# EAGLE design Statemachine_ST7735 (EAGLE 6.4)
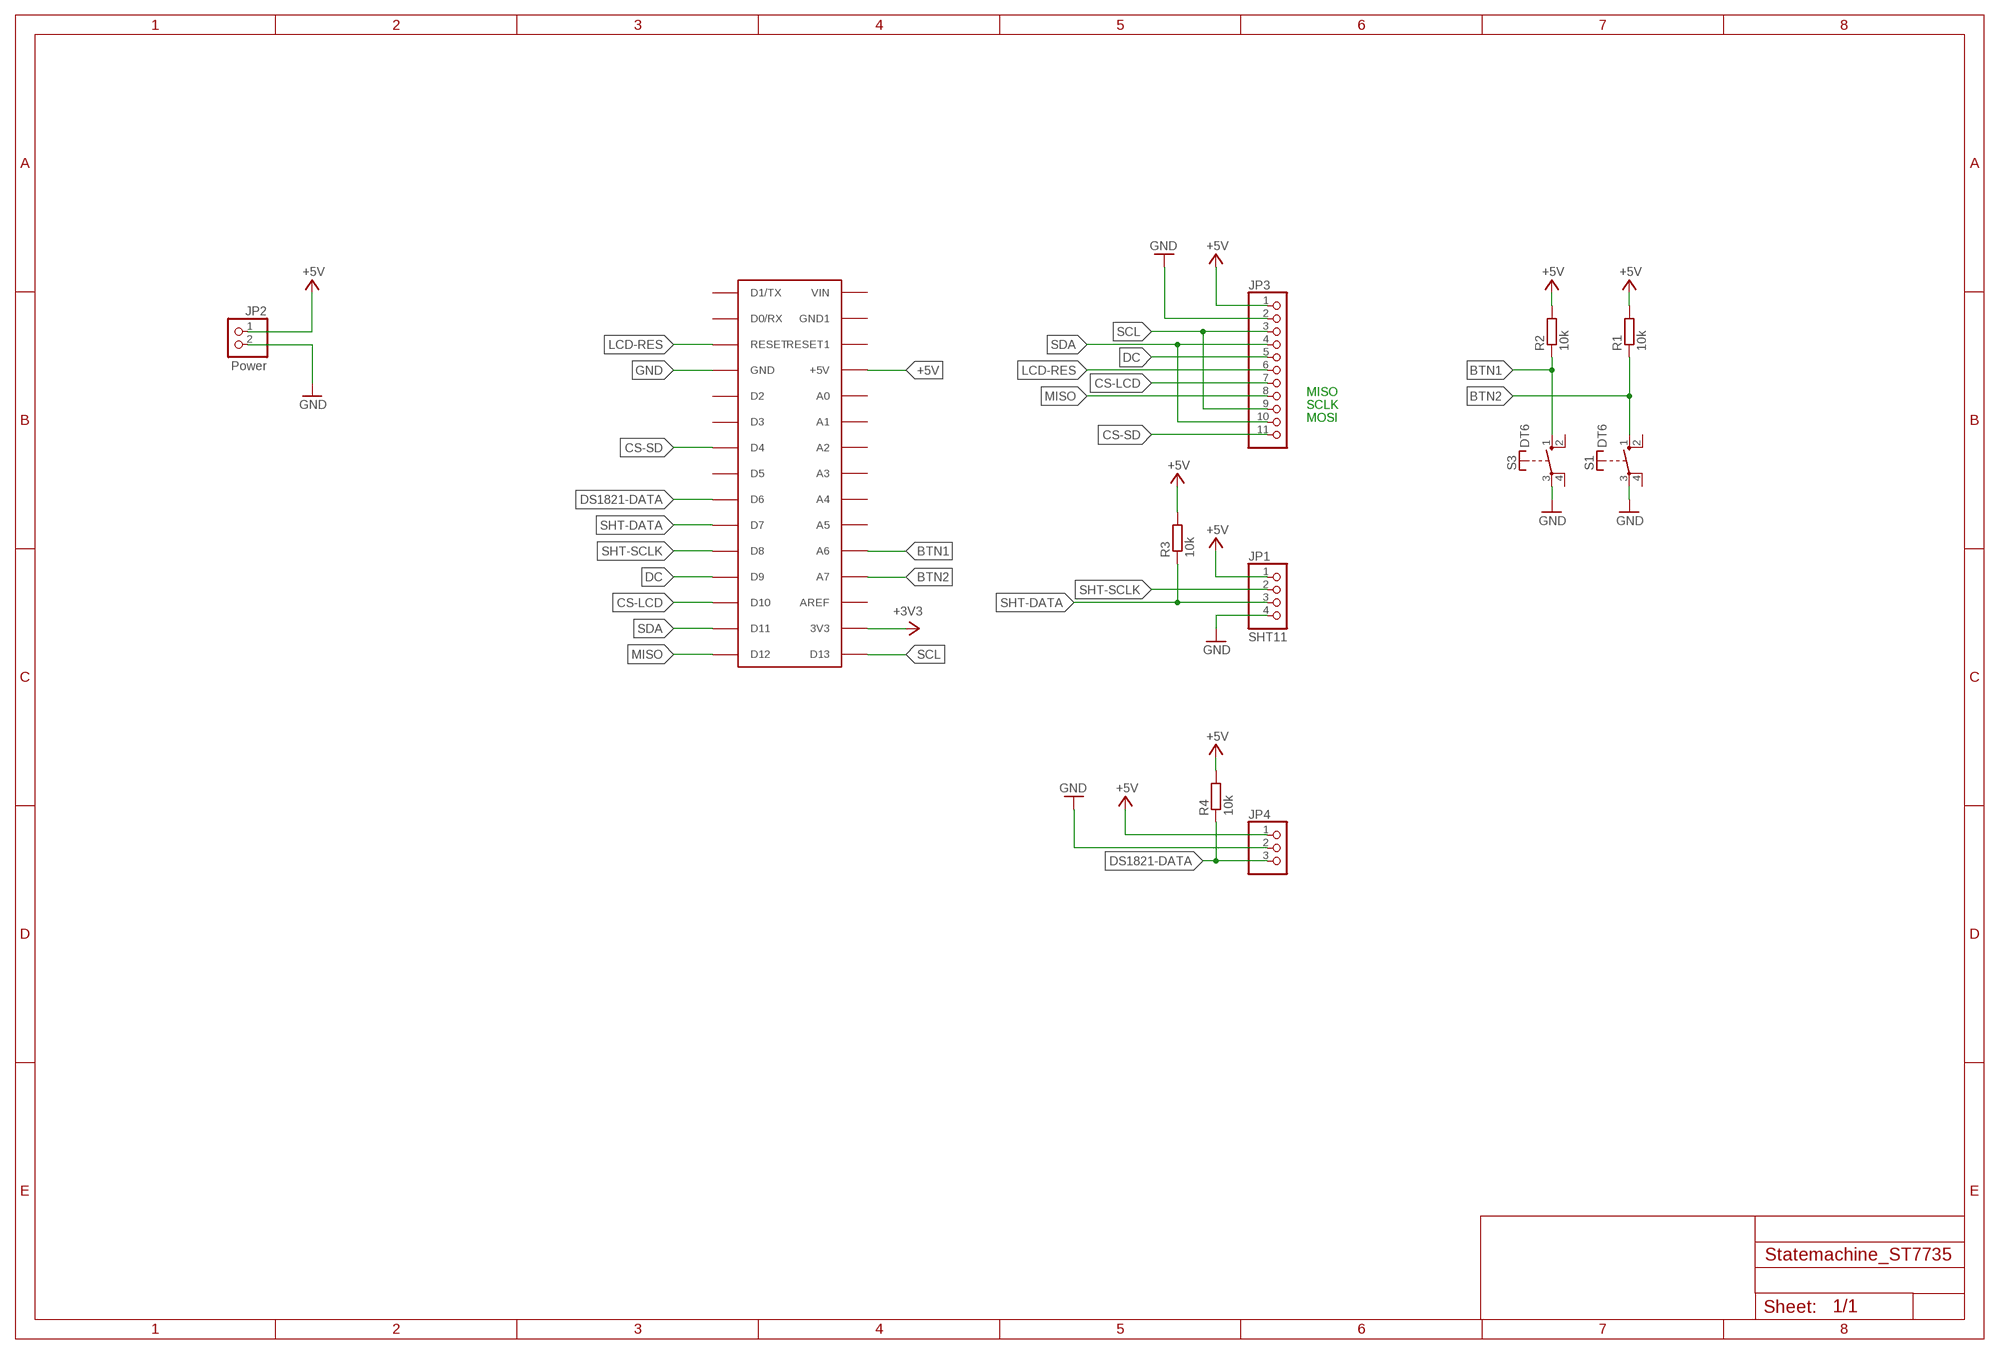
[diagram p0: schematic, sheet 1]

## Parts
JP1  SHT11  PINHD-1X4  [1X04]
JP2  Power  PINHD-1X2  [1X02]
JP3  PINHD-1X11  [1X11]
JP4  PINHD-1X3  [1X03]
R1  10k  R-EU_0207/10  [0207/10]
R2  10k  R-EU_0204/7  [0204/7]
R3  10k  R-EU_0204/7  [0204/7]
R4  10k  R-EU_0207/10  [0207/10]
S1  DT6  [DT6]
S3  DT6  [DT6]
U$1  ARDUINONANO  [PDIP-32]

## Nets
+3V3: U$1.3V3
+5V: JP1.1 JP2.1 JP3.1 JP4.1 R1.2 R2.2 R3.2 R4.2 U$1.+5V
BTN1: R2.1 S3.1(S) U$1.A6
BTN2: R1.1 S1.1(S) U$1.A7
CS-LCD: JP3.7 U$1.D10
CS-SD: JP3.11 U$1.D4
DC: JP3.5 U$1.D9
DS1821-DATA: JP4.3 R4.1 U$1.D6
GND: JP1.4 JP2.2 JP3.2 JP4.2 S1.3(P) S3.3(P) U$1.GND
LCD-RES: JP3.6 U$1.RESET
MISO: JP3.8 U$1.D12
SCL: JP3.3 JP3.9 U$1.D13
SDA: JP3.4 JP3.10 U$1.D11
SHT-DATA: JP1.3 R3.1 U$1.D7
SHT-SCLK: JP1.2 U$1.D8
Unconnected: S1.2(S) S1.4(P) S3.2(S) S3.4(P) U$1.A0 U$1.A1 U$1.A2 U$1.A3 U$1.A4 U$1.A5 U$1.AREF U$1.D0/RX U$1.D1/TX U$1.D2 U$1.D3 U$1.D5 U$1.GND1 U$1.RESET1 U$1.VIN

## Notes on the sheet
- MISO
- SCLK
- MOSI

## Library data of the parts
JP1 = pinhead:PINHD-1X4: PIN HEADER
JP2 = pinhead:PINHD-1X2: PIN HEADER
JP3 = pinhead:PINHD-1X11: PIN HEADER
JP4 = pinhead:PINHD-1X3: PIN HEADER
R1-R4 = resistor:R-EU_: RESISTOR, European symbol
S1 S3 = switch-misc:DT: ITT SWITCH
U$1 = arduino:ARDUINONANO

## Board
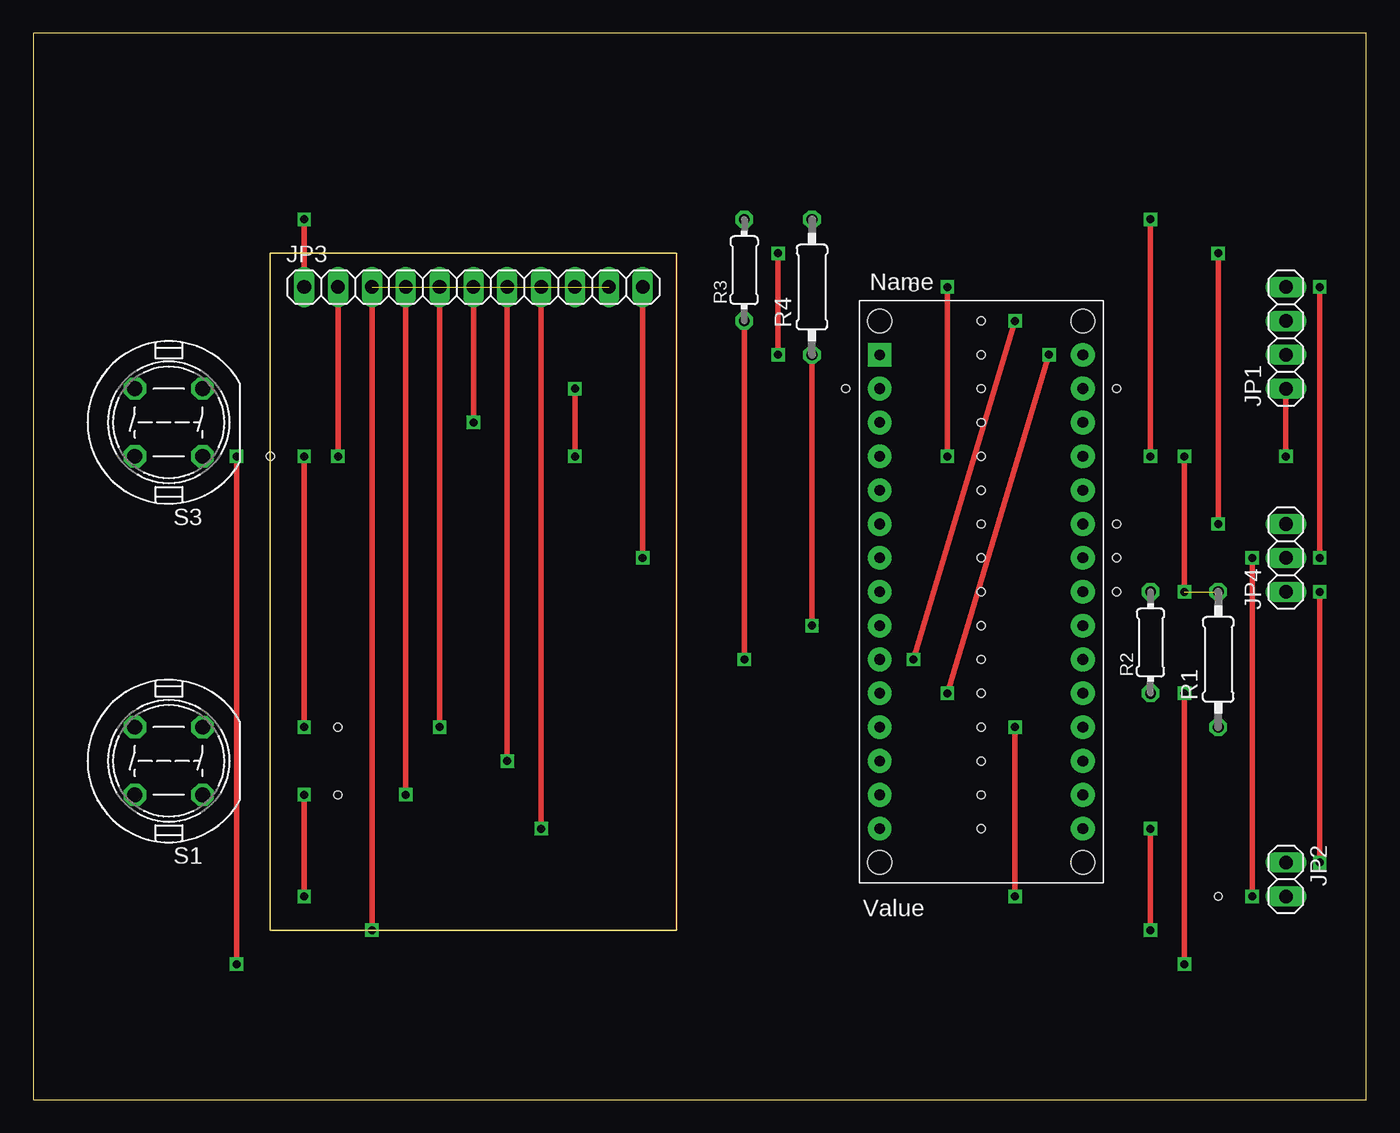
[diagram p1: board, top side]
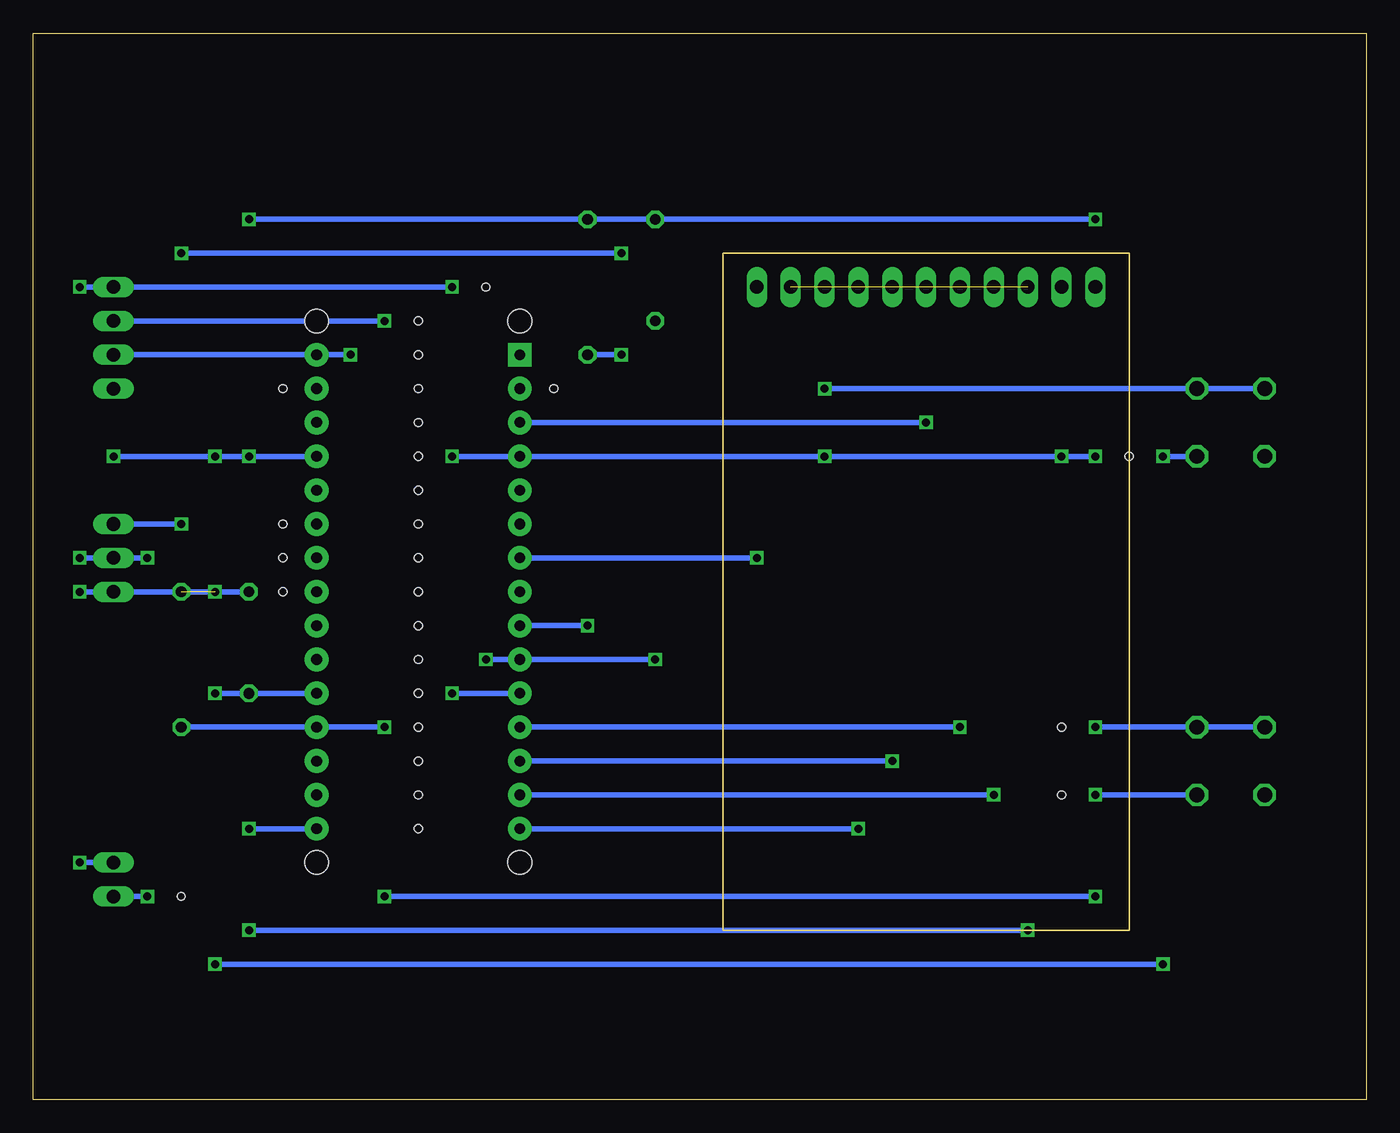
[diagram p2: board, bottom side, seen from below]

Size 100 x 80 mm. Coordinates in mm from the lower left corner, seen from the top.
Outline: 0,0 100,0 100,80 0,80 0,0
Copper layers (1*16): Top 0.035mm / dielectric 1.5mm / Bottom 0.035mm
Design rules "default": minimum track width 10mil, minimum drill 24mil, track to track 8mil, track to pad 8mil, pad to pad 8mil, via to via 8mil, smd to smd 8mil, copper to edge 40mil, drill to drill 8mil, minimum pad ring 10mil, minimum via ring 8mil, stop-mask expansion 4mil, vias tented up to drill 0mil, thermal gap 10mil
Holes 0.6 mm at 81.28,38.1 81.28,40.64 81.28,43.18 81.28,53.34 71.12,55.88 71.12,53.34 71.12,50.8 71.12,48.26 71.12,45.72 71.12,43.18 71.12,40.64 71.12,38.1 71.12,35.56 71.12,33.02 71.12,30.48 71.12,27.94 71.12,25.4 71.12,22.86 71.12,20.32 88.9,15.24 22.86,22.86 22.86,27.94 60.96,53.34 17.78,48.26 71.12,58.42 66.04,60.96

### Footprints (pad centres in the part's own frame; a part is rotated, then mirrored left to right if it is on the bottom)
1X04 = drill 1.016 long: 1 -3.81,0; 2 -1.27,0; 3 1.27,0; 4 3.81,0
1X02 = drill 1.016 long: 1 -1.27,0; 2 1.27,0
1X11 = drill 1.016 long: 1 -12.7,0; 2 -10.16,0; 3 -7.62,0; 4 -5.08,0; 5 -2.54,0; 6 0,0; 7 2.54,0; 8 5.08,0; 9 7.62,0; 10 10.16,0; 11 12.7,0
1X03 = drill 1.016 long: 1 -2.54,0; 2 0,0; 3 2.54,0
0207/10 = drill 0.813 octagon: 1 -5.08,0; 2 5.08,0
0204/7 = drill 0.813 octagon: 1 -3.81,0; 2 3.81,0
DT6 = drill 1.118 octagon: 1 -2.54,2.54; 2 2.54,2.54; 3 2.54,-2.54; 4 -2.54,-2.54
PDIP-32 = drill 0.8 pad 1.778: 3V3 15.24,-35.56; +5V 15.24,-10.16; A0 15.24,-12.7; A1 15.24,-15.24; A2 15.24,-17.78; A3 15.24,-20.32; A4 15.24,-22.86; A5 15.24,-25.4; A6 15.24,-27.94; A7 15.24,-30.48; AREF 15.24,-33.02; D0/RX 0,-5.08; D2 0,-12.7; D3 0,-15.24; D4 0,-17.78; D5 0,-20.32; D6 0,-22.86; D7 0,-25.4; D8 0,-27.94; D9 0,-30.48; D10 0,-33.02; D11 0,-35.56; D12 0,-38.1; D13 15.24,-38.1; GND 0,-10.16; GND1 15.24,-5.08; RESET 0,-7.62; RESET1 15.24,-7.62; VIN 15.24,-2.54 | drill 0.8 pad 1.778 square: D1/TX 0,-2.54 | hole 1.778: 0,0; 0,-40.64; 15.24,-40.64; 15.24,0

### Placement (x,y rotation side)
JP1  93.98,57.15 90 top
JP2  93.98,16.51 270 top
JP3  33.02,60.96 0 top
JP4  93.98,40.64 90 top
R1  88.9,33.02 90 top
R2  83.82,34.29 90 top
R3  53.34,62.23 90 top
R4  58.42,60.96 90 top
S1  10.16,25.4 180 top
S3  10.16,50.8 180 top
U$1  63.5,58.42 0 top

### Tracks (layer width: path | path; a pad name or v marks a point on that pad's centre or on a via)
+5V  (via drill 0.6)  (1 unrouted)
  Top 0.406: v20.32,66.04 JP3.1 | v83.82,66.04 v83.82,48.26 | v86.36,48.26 v86.36,38.1 | JP1.1 v93.98,48.26 | v96.52,38.1 v96.52,17.78
  Bottom 0.406: v20.32,66.04 R3.2 R4.2 v83.82,66.04 | R2.2 v86.36,38.1 JP4.1 v96.52,38.1 | U$1.+5V v83.82,48.26 v86.36,48.26 v93.98,48.26 | v96.52,17.78 JP2.1
BTN1  (via drill 0.6)
  Top 0.406: v86.36,30.48 v86.36,10.16 | v15.24,10.16 v15.24,48.26
  Bottom 0.406: R2.1 U$1.A6 v86.36,30.48 | v86.36,10.16 v15.24,10.16 | v15.24,48.26 S3.1
BTN2  (via drill 0.6)
  Top 0.406: v73.66,27.94 v73.66,15.24 | v20.32,15.24 v20.32,22.86
  Bottom 0.406: R1.1 U$1.A7 v73.66,27.94 | v73.66,15.24 v20.32,15.24 | v20.32,22.86 S1.1
CS-LCD  (via drill 0.6)
  Top 0.406: v35.56,25.4 JP3.7
  Bottom 0.406: U$1.D10 v35.56,25.4
CS-SD  (via drill 0.6)
  Top 0.406: v45.72,40.64 JP3.11
  Bottom 0.406: U$1.D4 v45.72,40.64
DC  (via drill 0.6)
  Top 0.406: v30.48,27.94 JP3.5
  Bottom 0.406: U$1.D9 v30.48,27.94
DS1821-DATA  (via drill 0.6)
  Top 0.406: v58.42,35.56 R4.1 | v88.9,43.18 v88.9,63.5 | v55.88,63.5 v55.88,55.88
  Bottom 0.406: U$1.D6 v58.42,35.56 | JP4.3 v88.9,43.18 | v88.9,63.5 v55.88,63.5 | v55.88,55.88 R4.1
GND  (via drill 0.6)
  Top 0.406: v96.52,40.64 v96.52,60.96 | v22.86,48.26 JP3.2 | v20.32,27.94 v20.32,48.26 | v40.64,48.26 v40.64,53.34 | v68.58,48.26 v68.58,60.96 | v91.44,15.24 v91.44,40.64
  Bottom 0.406: v96.52,60.96 JP1.4 v68.58,60.96 | v96.52,40.64 JP4.2 v91.44,40.64 | S1.3 v20.32,27.94 | v20.32,48.26 v22.86,48.26 v40.64,48.26 U$1.GND v68.58,48.26 | v40.64,53.34 S3.3 | JP2.2 v91.44,15.24
LCD-RES  (via drill 0.6)
  Top 0.406: v33.02,50.8 JP3.6
  Bottom 0.406: U$1.RESET v33.02,50.8
MISO  (via drill 0.6)
  Top 0.406: v38.1,20.32 JP3.8
  Bottom 0.406: U$1.D12 v38.1,20.32
SCL  (via drill 0.6)  (1 unrouted)
  Top 0.406: v25.4,12.7 JP3.3 | v83.82,20.32 v83.82,12.7
  Bottom 0.406: U$1.D13 v83.82,20.32 | v83.82,12.7 v25.4,12.7
SDA  (via drill 0.6)  (1 unrouted)
  Top 0.406: v27.94,22.86 JP3.4
  Bottom 0.406: U$1.D11 v27.94,22.86
SHT-DATA  (via drill 0.6)
  Top 0.406: v53.34,33.02 R3.1 | v73.66,58.42 v66.04,33.02
  Bottom 0.406: v53.34,33.02 U$1.D7 v66.04,33.02 | JP1.3 v73.66,58.42
SHT-SCLK  (via drill 0.6)
  Top 0.406: v76.2,55.88 v68.58,30.48
  Bottom 0.406: JP1.2 v76.2,55.88 | v68.58,30.48 U$1.D8